# Altium schematic sheet Keyboard.SchDoc
size A4
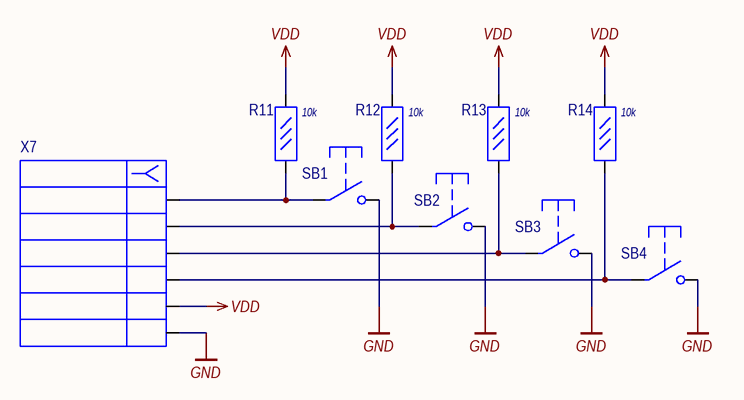
[diagram p0: Keyboard.SchDoc]

## Parts
R11  R: 10k  [Resistor SMD 1206]  (hidden comment: Resistor (0.05W))
R12  R: 10k  [Resistor SMD 1206]  (hidden comment: Resistor (0.05W))
R13  R: 10k  [Resistor SMD 1206]  (hidden comment: Resistor (0.05W))
R14  R: 10k  [Resistor SMD 1206]  (hidden comment: Resistor (0.05W))
SB1  Button  [BUTTON SMD]  (value not drawn)
SB2  Button  [BUTTON SMD]  (value not drawn)
SB3  Button  [BUTTON SMD]  (value not drawn)
SB4  Button  [BUTTON SMD]  (value not drawn)
X7  KBD_Connector  [KBD_Connector]  (value not drawn)

## Nets
GND: SB1.2 SB2.2 SB3.2 SB4.2 X7.6
VDD: R11.1 R12.1 R13.1 R14.1 X7.5
NetR11_2: R11.2 SB1.1 X7.1
NetR12_2: R12.2 SB2.1 X7.2
NetR13_2: R13.2 SB3.1 X7.3
NetR14_2: R14.2 SB4.1 X7.4

## Library data of the parts
X7 = KBD_Connector: pin to pad: 4>6 6>4